# EAGLE design PoEInjector4ChUnregulated (EAGLE 5.09)
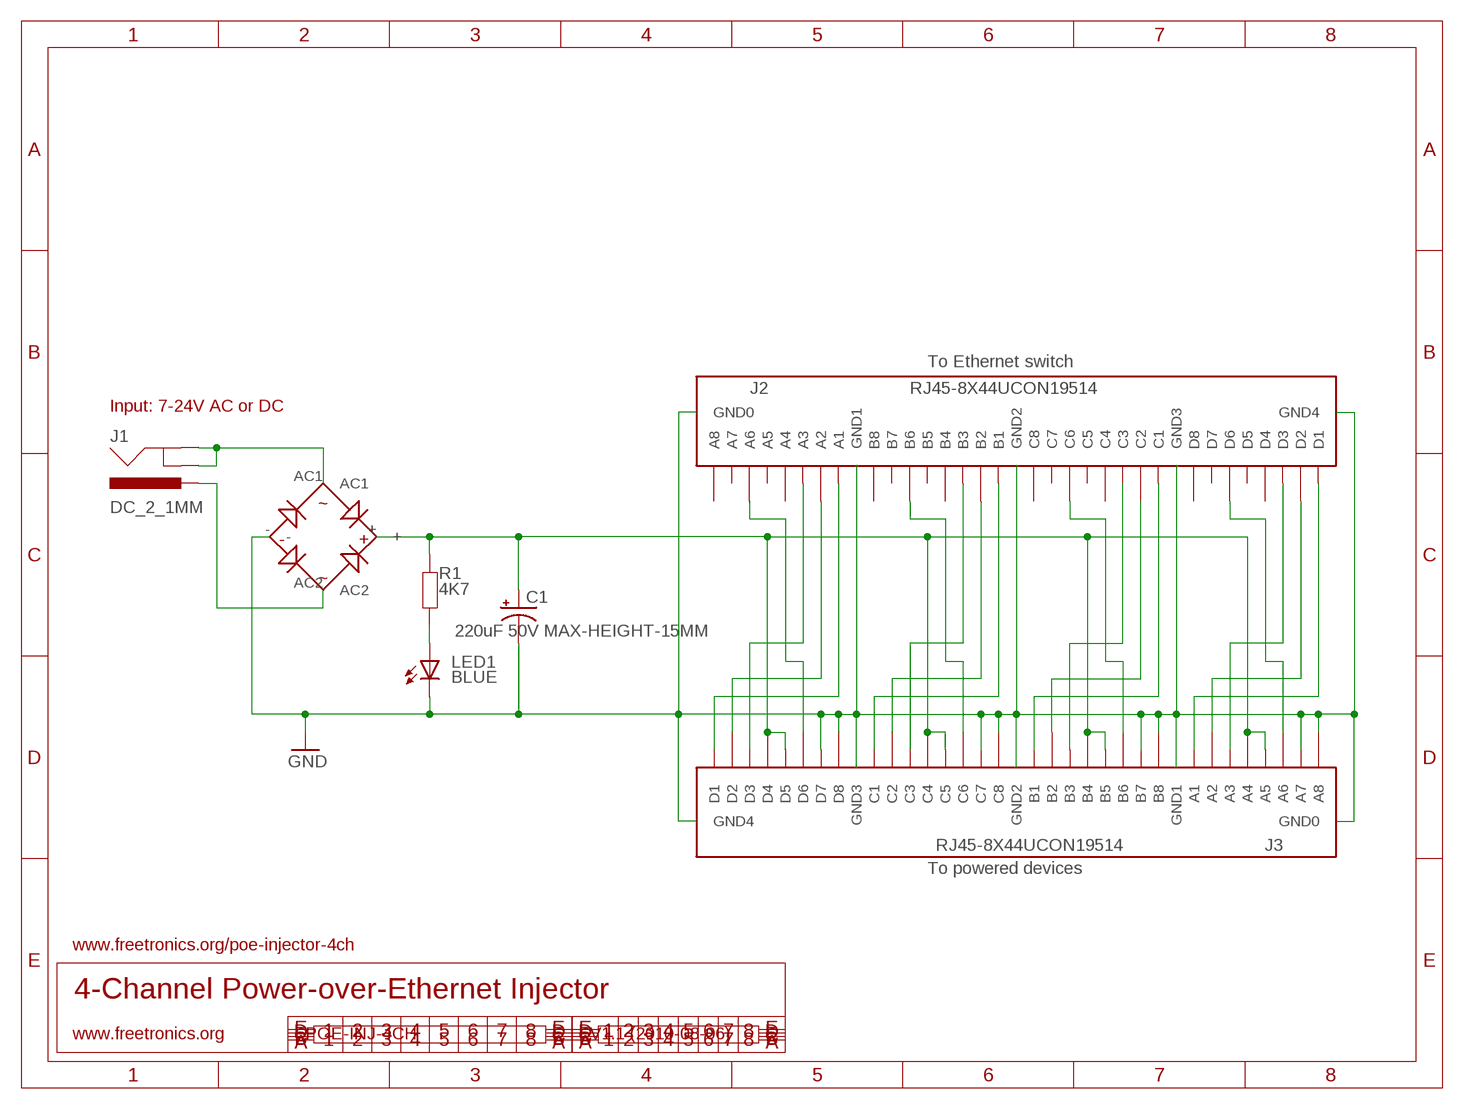
[diagram p0: schematic, sheet 1]

## Parts
BR1  W01G  BRIDGE-RECTIFIERW5-W10  [W5-W10]
C1  220uF 50V MAX-HEIGHT-15MM  CAP_POLPTH4  [CPOL-RADIAL-220UF-50V]
J1  DC_2_1MM  POWER_JACKPTH  [POWER_JACK_PTH]
J2  RJ45-8X44UCON19514  [RJ45-8X4]
J3  RJ45-8X44UCON19514  [RJ45-8X4]
LED1  BLUE  LED3MM  [LED3MM]
R1  4K7  RESISTORPTH4  [RES-4]

## Nets
GND: BR1.- C1.2(-) J2.GND0 J2.GND1 J2.GND2 J2.GND3 J2.GND4 J3.A7 J3.A8 J3.B7 J3.B8 J3.C7 J3.C8 J3.D7 J3.D8 J3.GND0 J3.GND1 J3.GND2 J3.GND3 J3.GND4 LED1.K(C)
N$5: BR1.AC1 J1.GND J1.GNDBREAK
N$6: LED1.A R1.2
N$8: BR1.AC2 J1.PWR
N$20: J2.A1 J3.D1
N$21: J2.A2 J3.D2
N$22: J2.A3 J3.D3
N$23: J2.A6 J3.D6
N$26: J2.B6 J3.C6
N$27: J2.B1 J3.C1
N$28: J2.C1 J3.B1
N$29: J2.D1 J3.A1
N$30: J2.B2 J3.C2
N$31: J2.C2 J3.B2
N$32: J2.D2 J3.A2
N$33: J2.B3 J3.C3
N$34: J2.C3 J3.B3
N$35: J2.D3 J3.A3
N$36: J2.C6 J3.B6
N$37: J2.D6 J3.A6
VCC: BR1.+ C1.1(+) J3.A4 J3.A5 J3.B4 J3.B5 J3.C4 J3.C5 J3.D4 J3.D5 R1.1
Unconnected: J2.A4 J2.A5 J2.A7 J2.A8 J2.B4 J2.B5 J2.B7 J2.B8 J2.C4 J2.C5 J2.C7 J2.C8 J2.D4 J2.D5 J2.D7 J2.D8

## Notes on the sheet
- To Ethernet switch
- Input: 7-24V AC or DC
- To powered devices
- www.freetronics.org/poe-injector-4ch
- 4-Channel Power-over-Ethernet Injector
- www.freetronics.org | POE-INJ-4CH | V1.1 (2010-08-06)

## Library data of the parts
BR1 = freetronics-2:BRIDGE-RECTIFIER
C1 = freetronics-2:CAP_POL: Capacitor Polarized These are standard SMD and PTH capacitors. Normally 10uF, 47uF, and 100uF in electrolytic and tantalum varieties. Always verify the external diameter of the through hole cap, it varies with capacity, voltage, and manufacturer. The EIA devices should be standard.
J1 = freetronics:POWER_JACK: Power Jack This is the standard 5.5mm barrel jack for power. The PTH is the most common, proven, reliable, footprint. All others are experimental. The Slot footprint only works if the mill layer is transmitted to the PCB fab house so be warned. Spark Fun Electronics SKU : PRT-00119. Mating wall wart : TOL-00298 (and others)
J2 J3 = freetronics-2:RJ45-8X4
LED1 = freetronics-2:LED: LEDs Standard schematic elements and footprints for 5mm, 3mm, 1206, and 0603 sized LEDs. 5mm - Spark Fun Electronics SKU : COM-00529 (and others)
R1 = freetronics-2:RESISTOR: Resistor Basic schematic elements and footprints for 0603, 1206, and PTH 1/10th watt (small) resistors.

## Board
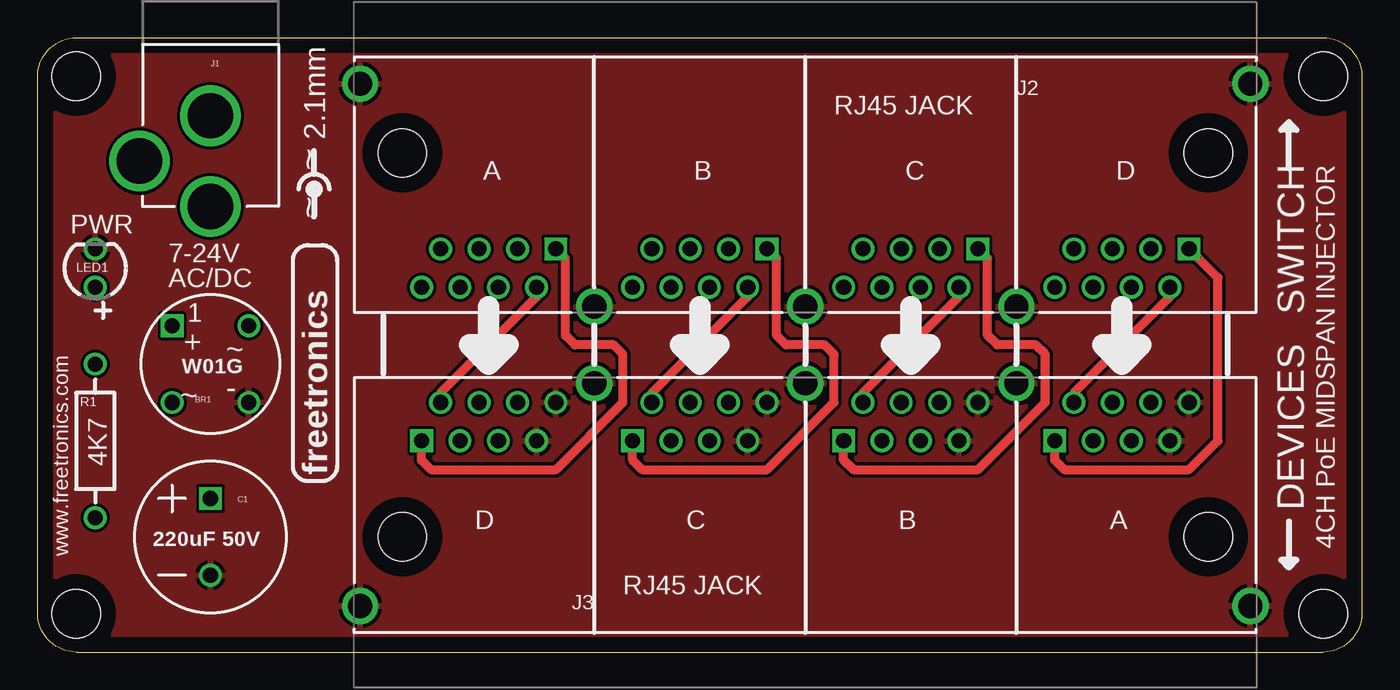
[diagram p1: board, top side]
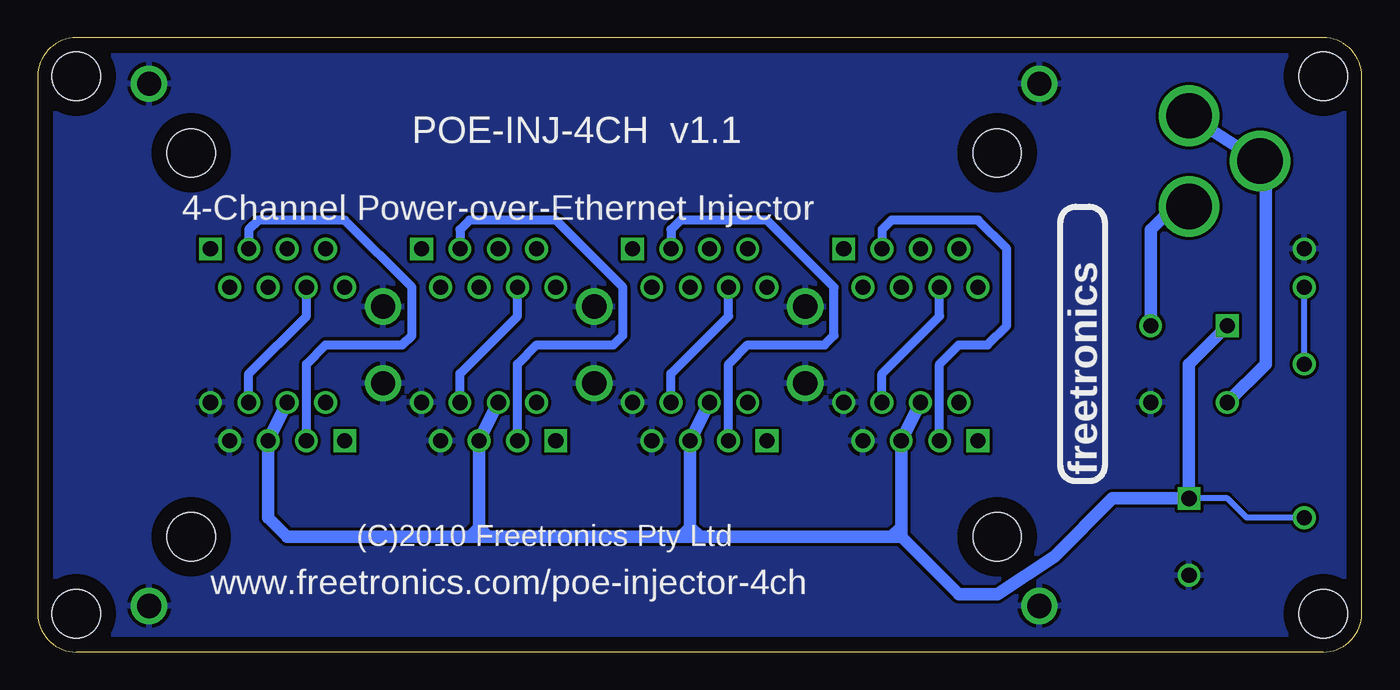
[diagram p2: board, bottom side, seen from below]

Size 87.63 x 40.64 mm. Coordinates in mm from the lower left corner, seen from the top.
Outline: 2.54,0 85.09,0 arc90 87.63,2.54 87.63,38.1 arc90 85.09,40.64 2.54,40.64 arc90 0,38.1 0,2.54 arc90 2.54,0
Copper layers (1*16): Top 0.035mm / dielectric 1.5mm / Bottom 0.035mm
Design rules "default": minimum track width 10mil, minimum drill 24mil, track to track 8mil, track to pad 8mil, pad to pad 8mil, via to via 8mil, smd to smd 8mil, copper to edge 40mil, drill to drill 8mil, minimum pad ring 10mil, minimum via ring 8mil, stop-mask expansion 4mil, vias tented up to drill 0mil, thermal gap 10mil
Holes 3.2 mm at 2.54,2.54 85.09,2.54 85.09,38.1 2.54,38.1

### Footprints (pad centres in the part's own frame; a part is rotated, then mirrored left to right if it is on the bottom)
W5-W10 = drill 1 square: + -2.54,2.54 | drill 1 round: - 2.54,-2.54; AC1 -2.54,-2.54; AC2 2.54,2.54
CPOL-RADIAL-220UF-50V = drill 1 square: 1 0,2.54 | drill 1 round: 2 0,-2.54
POWER_JACK_PTH = drill 2.997 round: GND 0,7.7; GNDBREAK 4.7,10.7; PWR 0,13.7
RJ45-8X4 = drill 1 square: A1 -16.51,-6.35; B1 -2.54,-6.35; C1 11.43,-6.35; D1 25.4,-6.35 | drill 1 round: A2 -17.78,-8.89; A3 -19.05,-6.35; A4 -20.32,-8.89; A5 -21.59,-6.35; A6 -22.86,-8.89; A7 -24.13,-6.35; A8 -25.4,-8.89; B2 -3.81,-8.89; B3 -5.08,-6.35; B4 -6.35,-8.89; B5 -7.62,-6.35; B6 -8.89,-8.89; B7 -10.16,-6.35; B8 -11.43,-8.89; C2 10.16,-8.89; C3 8.89,-6.35; C4 7.62,-8.89; C5 6.35,-6.35; C6 5.08,-8.89; C7 3.81,-6.35; C8 2.54,-8.89; D2 24.13,-8.89; D3 22.86,-6.35; D4 21.59,-8.89; D5 20.32,-6.35; D6 19.05,-8.89; D7 17.78,-6.35; D8 16.51,-8.89 | drill 1.6 round: GND0 -29.464,4.572; GND1 -13.97,-10.16; GND2 0,-10.16; GND3 13.97,-10.16; GND4 29.464,4.572 | hole 3.2: -26.67,0; 26.67,0
LED3MM = drill 1 round: A -1.27,0; K 1.27,0
RES-4 = drill 1 round: 1 -5.08,0; 2 5.08,0

### Placement (x,y rotation side)
BR1  11.43,19.05 0 top
C1  11.43,7.62 0 top
J1  11.43,43.18 180 top
J2  50.8,33.02 0 top
J3  50.8,7.62 180 top
LED1  3.81,25.4 90 top
R1  3.81,13.97 90 top

### Tracks (layer width: path | path; a pad name or v marks a point on that pad's centre or on a via)
GND
  pour Bottom: 0,2.54 0,38.1 arc-90 2.54,40.64 85.09,40.64 arc-90 87.63,38.1 87.63,2.54 arc-90 85.09,0 2.54,0 arc-90
  pour Top: 85.09,0 2.54,0 arc-90 0,2.54 0,38.1 arc-90 2.54,40.64 85.09,40.64 arc-90 87.63,38.1 87.63,2.54 arc-90
N$5
  Bottom 0.813: J1.GND J1.GNDBREAK 6.35,31.75 6.35,19.05 BR1.AC1
N$6
  Bottom 0.406: R1.2 LED1.A
N$8
  Bottom 0.813: J1.PWR 12.7,29.21 13.97,27.94 BR1.AC2
N$20
  Top 0.61: J2.A1 34.92,26.04 34.92,20.95 35.56,20.32 38.1,20.32 38.73,19.68 38.73,16.51 34.29,12.06 26.04,12.06 25.4,12.7 J3.D1
N$21
  Top 0.61: J2.A2 33.02,23.5 26.67,17.14 J3.D2
N$22
  Bottom 0.61: J2.A3 31.75,27.94 31.11,28.57 25.4,28.57 23.5,26.67 23.5,21.59 24.77,20.32 26.67,20.32 27.94,19.05 J3.D3
N$23
  Bottom 0.61: J2.A6 27.94,22.23 31.75,18.41 J3.D6
N$26
  Bottom 0.61: J2.B6 41.91,22.23 45.72,18.41 J3.C6
N$27
  Top 0.61: J2.B1 48.9,26.04 48.9,20.95 49.53,20.32 52.07,20.32 52.7,19.68 52.7,16.51 48.26,12.06 40.01,12.06 39.37,12.7 J3.C1
N$28
  Top 0.61: J2.C1 62.87,26.04 62.87,20.95 63.5,20.32 66.04,20.32 66.67,19.68 66.67,16.51 62.23,12.06 53.98,12.06 53.34,12.7 J3.B1
N$29
  Top 0.61: J3.A1 67.31,12.7 67.94,12.06 76.2,12.06 78.11,13.97 78.11,24.77 J2.D1
N$30
  Top 0.61: J2.B2 46.99,23.5 40.64,17.14 J3.C2
N$31
  Top 0.61: J2.C2 60.96,23.5 54.61,17.14 J3.B2
N$32
  Top 0.61: J3.A2 68.58,17.14 74.93,23.5 J2.D2
N$33
  Bottom 0.61: J3.C3 41.91,19.05 40.64,20.32 35.56,20.32 34.92,20.95 34.92,24.13 39.37,28.57 45.09,28.57 45.72,27.94 J2.B3
N$34
  Bottom 0.61: J2.C3 59.69,27.94 59.05,28.57 53.34,28.57 48.9,24.13 48.9,20.95 49.53,20.32 54.61,20.32 55.88,19.05 J3.B3
N$35
  Bottom 0.61: J2.D3 73.66,27.94 73.03,28.57 67.31,28.57 62.87,24.13 62.87,20.95 63.5,20.32 68.58,20.32 69.85,19.05 J3.A3
N$36
  Bottom 0.61: J3.B6 59.69,18.41 55.88,22.23 J2.C6
N$37
  Bottom 0.61: J2.D6 69.85,22.23 73.66,18.41 J3.A6
VCC
  Bottom 0.406: R1.1 7.62,8.89 8.89,10.16 C1.1
  Bottom 0.813: BR1.+ 11.43,19.05 C1.1 16.51,10.16 20.32,6.35 24.13,3.81 26.67,3.81 30.48,7.62 | J3.D4 J3.D5 30.48,8.26 | J3.C4 J3.C5 44.45,8.26 | J3.B4 J3.B5 58.42,8.26 | J3.A4 J3.A5 72.39,8.89 71.12,7.62 59.05,7.62 | 30.48,7.62 30.48,8.26 | 44.45,7.62 44.45,8.26 | 58.42,7.62 58.42,8.26 | 30.48,7.62 31.11,7.62 | 31.11,7.62 43.81,7.62 | 43.81,7.62 44.45,7.62 | 45.09,7.62 57.78,7.62 | 57.78,7.62 58.42,7.62 | 44.45,8.26 45.09,7.62 | 44.45,7.62 45.09,7.62 | 43.81,7.62 44.45,8.26 | 57.78,7.62 58.42,8.26 | 58.42,7.62 59.05,7.62 | 58.42,8.26 59.05,7.62 | 30.48,8.26 31.11,7.62

### Text on the board
tPlace: RJ45 JACK | 2.1mm | ~ | ~ | PWR | 7-24V | AC/DC | SWITCH | W01G | freetronics | DEVICES | 220uF 50V | 4CH PoE MIDSPAN INJECTOR | www.freetronics.com | RJ45 JACK
bPlace: POE-INJ-4CH v1.1 | 4-Channel Power-over-Ethernet Injector | freetronics | (C)2010 Freetronics Pty Ltd | www.freetronics.com/poe-injector-4ch